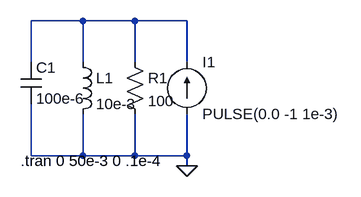
[diagram p0: schematic Parallel_RLC.asc]
Parallel_RLC.asc, the LTspice schematic file:
Version 4
SHEET 1 880 680
WIRE -112 -96 -192 -96
WIRE -32 -96 -112 -96
WIRE 48 -96 -32 -96
WIRE -192 -32 -192 -96
WIRE -112 -32 -112 -96
WIRE -32 -32 -32 -96
WIRE 48 -32 48 -96
WIRE -192 112 -192 32
WIRE -112 112 -112 48
WIRE -112 112 -192 112
WIRE -32 112 -32 48
WIRE -32 112 -112 112
WIRE 48 112 48 48
WIRE 48 112 -32 112
WIRE 48 128 48 112
FLAG 48 128 0
SYMBOL res -48 -48 R0
SYMATTR InstName R1
SYMATTR Value 100
SYMBOL ind -128 -48 R0
SYMATTR InstName L1
SYMATTR Value 10e-3
SYMBOL cap -208 -32 R0
SYMATTR InstName C1
SYMATTR Value 100e-6
SYMBOL current 48 48 M180
WINDOW 0 24 80 Left 2
WINDOW 3 24 0 Left 2
WINDOW 123 0 0 Left 2
WINDOW 39 0 0 Left 2
SYMATTR InstName I1
SYMATTR Value PULSE(0.0 -1 1e-3)
TEXT -208 120 Left 2 !.tran 0 50e-3 0 .1e-4

The netlist it stands for:
* Parallel_RLC.asc
R1 N001 0 100
L1 N001 0 10e-3
C1 N001 0 100e-6
I1 0 N001 PULSE(0.0 -1 1e-3)
.tran 0 50e-3 0 .1e-4
.backanno
.end